# Altium schematic sheet 02-MCU.SchDoc
size A4; DocumentNumber: 2; SheetNumber: 2; SheetTotal: 8
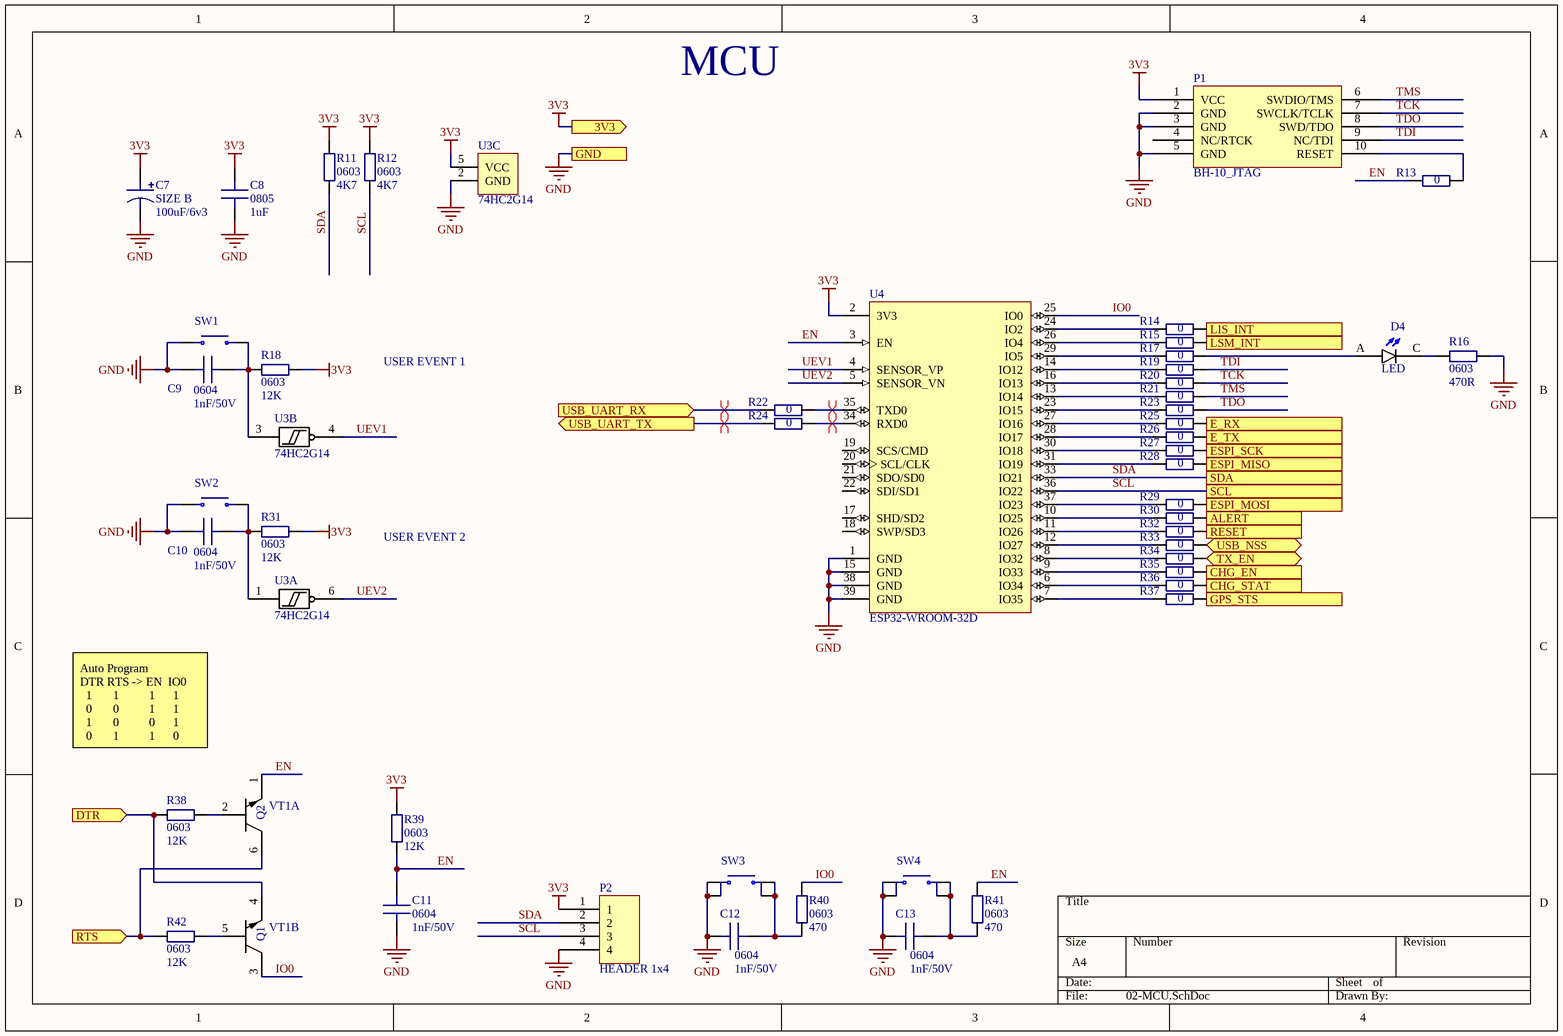
[diagram p0: 02-MCU.SchDoc]

## Parts
C7  Size: SIZE B  [CAP_SIZE_B]  (hidden comment: 100uF/6v3)
C8  Size: 0805  [C0805]  (hidden comment: 1uF)
C9  Size: 0604  [C0604]  (hidden comment: 1nF/50V)
C10  Size: 0604  [C0604]  (hidden comment: 1nF/50V)
C11  Size: 0604  [C0604]  (hidden comment: 1nF/50V)
C12  Size: 0604  [C0604]  (hidden comment: 1nF/50V)
C13  Size: 0604  [C0604]  (hidden comment: 1nF/50V)
D4  LED  [LED_0604]
P1  BH-10_JTAG  [BH-10R]
P2  HEADER 1x4  [HEADER 1x4 2.54]
R11  Size: 0603  Resistance: 4K7  [R0604]
R12  Size: 0603  Resistance: 4K7  [R0604]
R13  Resistance: 0  [R0402]
R14  Resistance: 0  [R0402]
R15  Resistance: 0  [R0402]
R16  Size: 0603  Resistance: 470R  [R0604]
R17  Resistance: 0  [R0402]
R18  Size: 0603  Resistance: 12K  [R0604]
R19  Resistance: 0  [R0402]
R20  Resistance: 0  [R0402]
R21  Resistance: 0  [R0402]
R22  Resistance: 0  [R0402]
R23  Resistance: 0  [R0402]
R24  Resistance: 0  [R0402]
R25  Resistance: 0  [R0402]
R26  Resistance: 0  [R0402]
R27  Resistance: 0  [R0402]
R28  Resistance: 0  [R0402]
R29  Resistance: 0  [R0402]
R30  Resistance: 0  [R0402]
R31  Size: 0603  Resistance: 12K  [R0604]
R32  Resistance: 0  [R0402]
R33  Resistance: 0  [R0402]
R34  Resistance: 0  [R0402]
R35  Resistance: 0  [R0402]
R36  Resistance: 0  [R0402]
R37  Resistance: 0  [R0604]
R38  Size: 0603  Resistance: 12K  [R0604]
R39  Size: 0603  Resistance: 12K  [R0604]
R40  Size: 0603  Resistance: 470  [R0604]
R41  Size: 0603  Resistance: 470  [R0604]
R42  Size: 0603  Resistance: 12K  [R0604]
SW1  SWITCH_GEN_2P  [SW_GENERIC-SIDE]  (value not drawn)
SW2  SWITCH_GEN_2P  [SW_GENERIC-SIDE]  (value not drawn)
SW3  SWITCH_GEN_4P  [SW_4x4x1.5]  (value not drawn)
SW4  SWITCH_GEN_4P  [SW_4x4x1.5]  (value not drawn)
U3  74HC2G14  [SOT363/SOT65P210X110-6N]  (parts A,B,C of 3)
U4  ESP32-WROOM-32D  [ESP32-WROOM-32]
VT1  BC847BDW1T1G  [SOT363/SOT65P210X110-6N]  (value not drawn)  (parts A,B of 2)

## Ports
3V3 (out), ALERT, CHG_EN, CHG_STAT, DTR (in), E_RX, E_TX, ESPI_MISO, ESPI_MOSI, ESPI_SCK, GND, GPS_STS, LIS_INT, LSM_INT, RESET, RTS (in), SCL, SDA, TX_EN (bidir), USB_NSS (bidir), USB_UART_RX (in), USB_UART_TX (out)

## Nets
3V3: C7.1 C8.2 P1.1(VCC) P2.1 R11.1 R12.1 R18.1 R31.1 R39.1 U3.5(VCC) U4.2(3V3) ; port 3V3
GND: C7.2 C8.1 C9.1 C10.1 C11.1 C12.1 C13.1 P1.2(GND) P1.3(GND) P1.5(GND) P2.4 R16.1 SW1.1 SW2.1 SW3.1 SW3.3 SW4.1 SW4.3 U3.2(GND) U4.1(GND) U4.15(GND) U4.38(GND) U4.39(GND) ; port GND
ALERT: R30.2 ; port ALERT
CHG_EN: R35.2 ; port CHG_EN
CHG_STAT: R36.2 ; port CHG_STAT
DTR: R38.2 VT1.4 ; port DTR
E_RX: R25.2 ; port E_RX
E_TX: R26.2 ; port E_TX
EN: C11.2 R13.1 R39.2 R41.2 U4.3(EN) VT1.1
ESPI_MISO: R28.2 ; port ESPI_MISO
ESPI_MOSI: R29.2 ; port ESPI_MOSI
ESPI_SCK: R27.2 ; port ESPI_SCK
GPS_STS: R37.2 ; port GPS_STS
IO0: R40.2 U4.25(IO0) VT1.3
LIS_INT: R14.2 ; port LIS_INT
LSM_INT: R15.2 ; port LSM_INT
RESET: R32.2 ; port RESET
RTS: R42.2 VT1.6 ; port RTS
SCL: P2.3 R12.2 U4.36(IO22) ; port SCL
SDA: P2.2 R11.2 U4.33(IO21) ; port SDA
TCK: P1.7(SWCLK/TCLK) R20.2
TDI: P1.9(NC/TDI) R19.2
TDO: P1.8(SWD/TDO) R23.2
TMS: P1.6(SWDIO/TMS) R21.2
TX_EN: R34.2 ; port TX_EN
UEV1: U3.4(2Y) U4.4(SENSOR_VP)
UEV2: U3.6(1Y) U4.5(SENSOR_VN)
USB_NSS: R33.2 ; port USB_NSS
USB_UART_RX: R22.1 ; port USB_UART_RX
USB_UART_TX: R24.1 ; port USB_UART_TX
NetC9_2: C9.2 R18.2 SW1.2 U3.3(2A)
NetC10_2: C10.2 R31.2 SW2.2 U3.1(1A)
NetC12_2: C12.2 R40.1 SW3.2 SW3.4
NetC13_2: C13.2 R41.1 SW4.2 SW4.4
NetD4_A: D4.A R17.2
NetD4_C: D4.C R16.2
NetP1_10: P1.10(RESET) R13.2
NetR14_1: R14.1 U4.24(IO2)
NetR15_1: R15.1 U4.26(IO4)
NetR17_1: R17.1 U4.29(IO5)
NetR19_1: R19.1 U4.14(IO12)
NetR20_1: R20.1 U4.16(IO13)
NetR21_1: R21.1 U4.13(IO14)
NetR22_2: R22.2 U4.35(TXD0)
NetR23_1: R23.1 U4.23(IO15)
NetR24_2: R24.2 U4.34(RXD0)
NetR25_1: R25.1 U4.27(IO16)
NetR26_1: R26.1 U4.28(IO17)
NetR27_1: R27.1 U4.30(IO18)
NetR28_1: R28.1 U4.31(IO19)
NetR29_1: R29.1 U4.37(IO23)
NetR30_1: R30.1 U4.10(IO25)
NetR32_1: R32.1 U4.11(IO26)
NetR33_1: R33.1 U4.12(IO27)
NetR34_1: R34.1 U4.8(IO32)
NetR35_1: R35.1 U4.9(IO33)
NetR36_1: R36.1 U4.6(IO34)
NetR37_1: R37.1 U4.7(IO35)
NetR38_1: R38.1 VT1.2
NetR42_1: R42.1 VT1.5

Not connected (* = marked no-connect by the designer): P1 4(NC/RTCK); U4 17(SHD/SD2) 18(SWP/SD3) 19(SCS/CMD) 20(SCL/CLK) 21(SDO/SD0) 22(SDI/SD1)

## Layout directives
differential pair: NetR22_2, NetR24_2, USB_UART_RX, USB_UART_TX

## Notes on the sheet
- MCU
- USER EVENT 1
- USER EVENT 2
- Auto Program
  DTR RTS -> EN  IO0
  1       1          1      1
  0       0          1      1
  1       0          0      1
  0       1          1      0
- (in symbol BC847BDW1T1G, part A) Q2
- (in symbol BC847BDW1T1G, part B) Q1

## Library data of the parts
C7 = C_GEN_POL_: General capacitor; Capacity: 100uF/6v3; Value: 100uF/6v3
C8-C13 = C_GEN_NONPOL: General capacitor
  C8: Capacity: 1uF; Value: 1uF
  C9-C13: Capacity: 1nF/50V; Value: 1nF/50V
D4 = LED: Led General; MF: Dialight; MP: 598-8140-107F; SnapEDA_Link: https://www.snapeda.com/parts/598-8140-107F/Dialight/view-part/?ref=snap; Price: None; Availability: Unavailable; Package: 0805 Dialight; Value: *
R11-R42 = R_GENERAL: Resistor General
SW1 SW2 = SWITCH_GEN_2P: SWITCH DIP 4.3 mm
SW3 SW4 = SWITCH_GEN_4P: SWITCH DIP 4.3 mm
U4 = ESP32-WROOM-32D: / IC: SoC; GPIO, I2C, I2S, IR, SD, SDIO, SPI, UART; 2.7Г·3.6VDC; 20dBm /; MF: Espressif Systems; MP: ESP32-WROOM-32D; Package: Module Espressif Systems; Availability: Unavailable; Price: None; SnapEDA_Link: https://www.snapeda.com/parts/ESP32-WROOM-32D/Espressif%20Systems/view-part/?ref=snap; Value: *